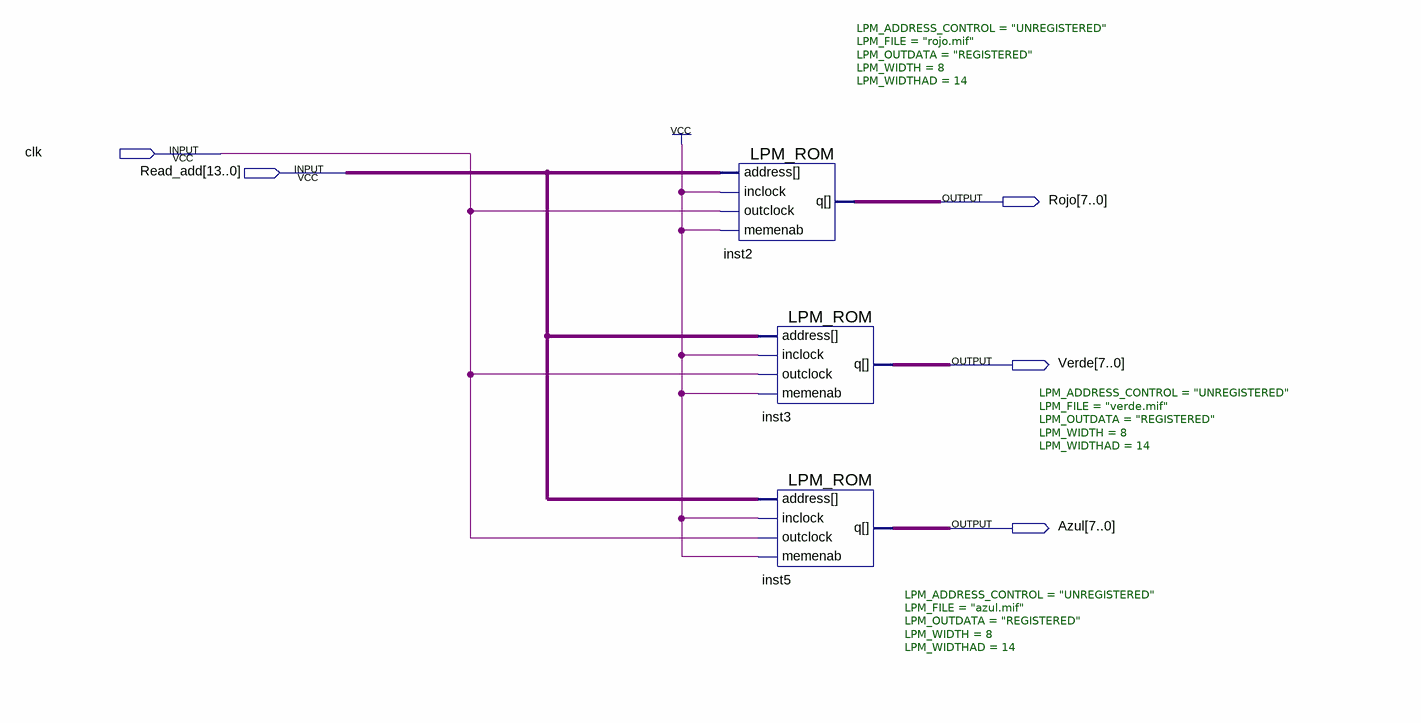
[diagram p0: schematic sheet]
// Quartus schematic Block1.bdf as structural Verilog: 3 symbols, 5 pins
module Block1 (
  input  clk,
  input  [13:0] Read_add,
  output [7:0] Rojo,
  output [7:0] Verde,
  output [7:0] Azul
);

  LPM_ROM #(.LPM_ADDRESS_CONTROL("UNREGISTERED"), .LPM_FILE("rojo.mif"), .LPM_OUTDATA("REGISTERED"), .LPM_WIDTH(8), .LPM_WIDTHAD(14)) inst2 (
    .address(Read_add), .inclock(1'b1), .outclock(clk), .memenab(1'b1), .q(Rojo));
  LPM_ROM #(.LPM_ADDRESS_CONTROL("UNREGISTERED"), .LPM_FILE("verde.mif"), .LPM_OUTDATA("REGISTERED"), .LPM_WIDTH(8), .LPM_WIDTHAD(14)) inst3 (
    .address(Read_add), .inclock(1'b1), .outclock(clk), .memenab(1'b1), .q(Verde));
  LPM_ROM #(.LPM_ADDRESS_CONTROL("UNREGISTERED"), .LPM_FILE("azul.mif"), .LPM_OUTDATA("REGISTERED"), .LPM_WIDTH(8), .LPM_WIDTHAD(14)) inst5 (
    .address(Read_add), .inclock(1'b1), .outclock(clk), .memenab(1'b1), .q(Azul));
endmodule
